# EAGLE design gearshift_controller (EAGLE 9.5.1)

## Sheet 1 of 2
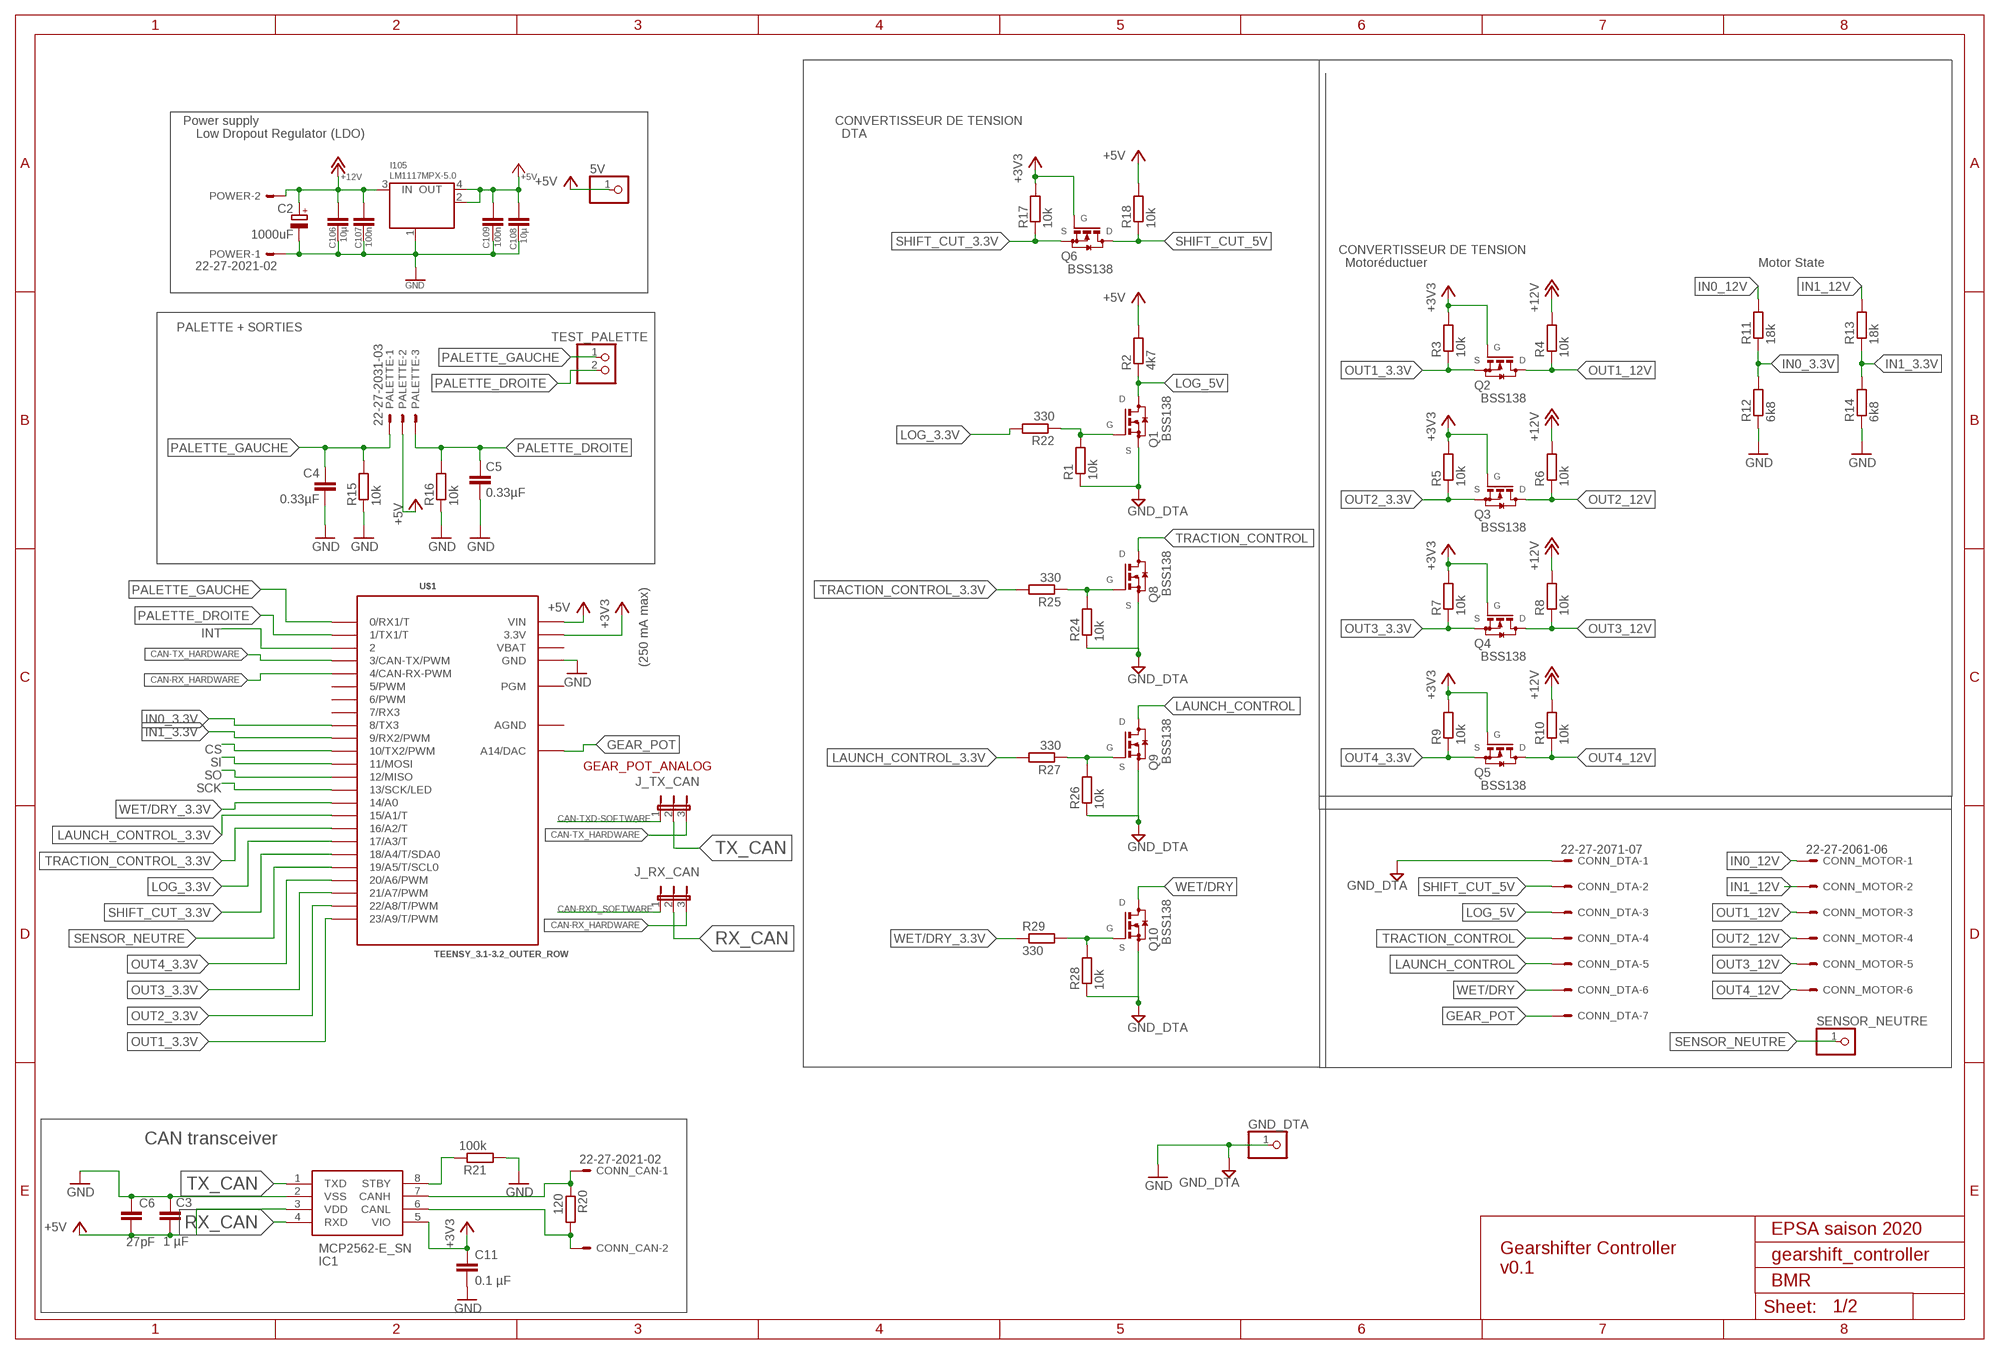
[diagram p0: schematic, sheet 1]

### Parts
5V  PINHD-1X1  [1X01]
C2  1000uF  CPOL-EUE25-10AXIAL  [E25-10]
C3  1 µF  C-EUC0805  [C0805]
C4  0.33µF  C-EUC0805  [C0805]
C5  0.33µF  C-EUC0805  [C0805]
C6  27pF  C-EUC0805  [C0805]
C11  0.1 µF  C-EUC0805  [C0805]
C106  10µ  C-EUC0805  [C0805]
C107  100n  C-EUC0603  [C0603]
C108  10µ  C-EUC0805  [C0805]
C109  100n  C-EUC0603  [C0603]
CONN_CAN  22-27-2021-02  [6410-02]
CONN_DTA  22-27-2071-07  [6410-07]
CONN_MOTOR  22-27-2061-06  [6410-06]
GND_DTA  PINHD-1X1  [1X01]
I105  LM1117MPX-5.0  0022_LM1117IMPX-5.0  [LINEAR_SOT223]
IC1  MCP2562-E_SN  [SOIC127P600X175-8N]
J_RX_CAN  JP2E  [JP2]
J_TX_CAN  JP2E  [JP2]
PALETTE  22-27-2031-03  [6410-03]
POWER  22-27-2021-02  [6410-02]
Q1  BSS138  BSS123  [SOT23]
Q2  BSS138  BSS123  [SOT23]
Q3  BSS138  BSS123  [SOT23]
Q4  BSS138  BSS123  [SOT23]
Q5  BSS138  BSS123  [SOT23]
Q6  BSS138  BSS123  [SOT23]
Q8  BSS138  BSS123  [SOT23]
Q9  BSS138  BSS123  [SOT23]
Q10  BSS138  BSS123  [SOT23]
R1  10k  R-EU_R0805  [R0805]
R2  4k7  R-EU_R0805  [R0805]
R3  10k  R-EU_R0805  [R0805]
R4  10k  R-EU_R0805  [R0805]
R5  10k  R-EU_R0805  [R0805]
R6  10k  R-EU_R0805  [R0805]
R7  10k  R-EU_R0805  [R0805]
R8  10k  R-EU_R0805  [R0805]
R9  10k  R-EU_R0805  [R0805]
R10  10k  R-EU_R0805  [R0805]
R11  18k  R-EU_R0805  [R0805]
R12  6k8  R-EU_R0805  [R0805]
R13  18k  R-EU_R0805  [R0805]
R14  6k8  R-EU_R0805  [R0805]
R15  10k  R-EU_R0805  [R0805]
R16  10k  R-EU_R0805  [R0805]
R17  10k  R-EU_R0805  [R0805]
R18  10k  R-EU_R0805  [R0805]
R20  120  R-EU_R0805  [R0805]
R21  100k  R-EU_R0805  [R0805]
R22  330  R-EU_R0805  [R0805]
R24  10k  R-EU_R0805  [R0805]
R25  330  R-EU_R0805  [R0805]
R26  10k  R-EU_R0805  [R0805]
R27  330  R-EU_R0805  [R0805]
R28  10k  R-EU_R0805  [R0805]
R29  330  R-EU_R0805  [R0805]
SENSOR_NEUTRE  PINHD-1X1  [1X01]
TEST_PALETTE  PINHD-1X2  [1X02]
U$1  TEENSY_3.1-3.2_OUTER_ROW  [TEENSY_3.0-3.2&LC_OUTER_ROW]

### Nets
+3V3: C11.1 IC1.5(VIO) Q2.1(G) Q3.1(G) Q4.1(G) Q5.1(G) Q6.1(G) R3.2 R5.2 R7.2 R9.2 R17.2 U$1.3.3V U$1.3.3V1(3.3V) ; also sheet 2
+5V: 5V.1 C3.2 C6.2 C108.1 C109.2 I105.2(OUT) I105.4(OUT) IC1.3(VDD) PALETTE.2 R2.2 R18.2 U$1.VIN
+12V: C2.+ C106.1 C107.1 I105.3(IN) POWER.2 R4.2 R6.2 R8.2 R10.2
CAN-RX_HARDWARE: J_RX_CAN.3 U$1.4(4/CAN-RX-PWM)
CAN-RXD_SOFTWARE: J_RX_CAN.1 ; also sheet 2
CAN-TX_HARDWARE: J_TX_CAN.3 U$1.3(3/CAN-TX/PWM)
CAN-TXD-SOFTWARE: J_TX_CAN.1 ; also sheet 2
CS: U$1.10(10/TX2/PWM) ; also sheet 2
GEAR_POT: CONN_DTA.7 U$1.RESET/DAC(A14/DAC)
GND: C2.- C3.1 C4.2 C5.2 C6.1 C11.2 C106.2 C107.2 C108.2 C109.1 CONN_DTA.1 GND_DTA.1 I105.1(GND/ADJ) IC1.2(VSS) POWER.1 Q1.2(S) Q8.2(S) Q9.2(S) Q10.2(S) R1.1 R12.1 R14.1 R15.1 R16.1 R21.1 R24.1 R26.1 R28.1 U$1.GND U$1.GND1(GND) ; supply symbol labelled GND_DTA ; also sheet 2
IN0_3.3V: R11.1 R12.2 U$1.8(8/TX3)
IN0_12V: CONN_MOTOR.1 R11.2
IN1_3.3V: R13.1 R14.2 U$1.9(9/RX2/PWM)
IN1_12V: CONN_MOTOR.2 R13.2
INT: U$1.2 ; also sheet 2
LAUNCH_CONTROL: CONN_DTA.5 Q9.3(D)
LAUNCH_CONTROL_3.3V: R27.2 U$1.15/A1(15/A1/T)
LOG_3.3V: R22.2 U$1.17/A3(17/A3/T)
LOG_5V: CONN_DTA.3 Q1.3(D) R2.1
N$1: Q1.1(G) R1.2 R22.1
N$2: IC1.8(STBY) R21.2
N$4: CONN_CAN.1 IC1.7(CANH) R20.1
N$6: CONN_CAN.2 IC1.6(CANL) R20.2
N$8: Q8.1(G) R24.2 R25.1
N$9: Q9.1(G) R26.2 R27.1
N$10: Q10.1(G) R28.2 R29.2
OUT1_3.3V: Q2.2(S) R3.1 U$1.23/A9(23/A9/T/PWM)
OUT1_12V: CONN_MOTOR.3 Q2.3(D) R4.1
OUT2_3.3V: Q3.2(S) R5.1 U$1.22/A8(22/A8/T/PWM)
OUT2_12V: CONN_MOTOR.4 Q3.3(D) R6.1
OUT3_3.3V: Q4.2(S) R7.1 U$1.21/A7(21/A7/PWM)
OUT3_12V: CONN_MOTOR.5 Q4.3(D) R8.1
OUT4_3.3V: Q5.2(S) R9.1 U$1.20/A6(20/A6/PWM)
OUT4_12V: CONN_MOTOR.6 Q5.3(D) R10.1
PALETTE_DROITE: C5.1 PALETTE.3 R16.2 TEST_PALETTE.2 U$1.1(1/TX1/T)
PALETTE_GAUCHE: C4.1 PALETTE.1 R15.2 TEST_PALETTE.1 U$1.0(0/RX1/T)
RX_CAN: IC1.4(RXD) J_RX_CAN.2
SCK: U$1.13(13/SCK/LED) ; also sheet 2
SENSOR_NEUTRE: SENSOR_NEUTRE.1 U$1.19/A5(19/A5/T/SCL0)
SHIFT_CUT_3.3V: Q6.2(S) R17.1 U$1.18/A4(18/A4/T/SDA0)
SHIFT_CUT_5V: CONN_DTA.2 Q6.3(D) R18.1
SI: U$1.11(11/MOSI) ; also sheet 2
SO: U$1.12(12/MISO) ; also sheet 2
TRACTION_CONTROL: CONN_DTA.4 Q8.3(D)
TRACTION_CONTROL_3.3V: R25.2 U$1.16/A2(16/A2/T)
TX_CAN: IC1.1(TXD) J_TX_CAN.2
WET/DRY: CONN_DTA.6 Q10.3(D)
WET/DRY_3.3V: R29.1 U$1.14/A0
Unconnected: U$1.5(5/PWM) U$1.6(6/PWM) U$1.7(7/RX3) U$1.PGM

### Notes on the sheet
- Power supply | CONVERTISSEUR DE TENSION
- Low Dropout Regulator (LDO) | DTA
- G
- S | D
- CONVERTISSEUR DE TENSION
- Motoréductuer | Motor State
- PALETTE + SORTIES
- G
- S | D
- D
- G
- S
- G
- S | D
- D
- G
- S | G
- S | D
- (250 mA max)
- D
- G
- G | S | D
- GEAR_POT_ANALOG | S
- D
- G
- S
- CAN transceiver
- EPSA saison 2020
- Gearshifter Controller
  v0.1
- BMR

## Sheet 2 of 2
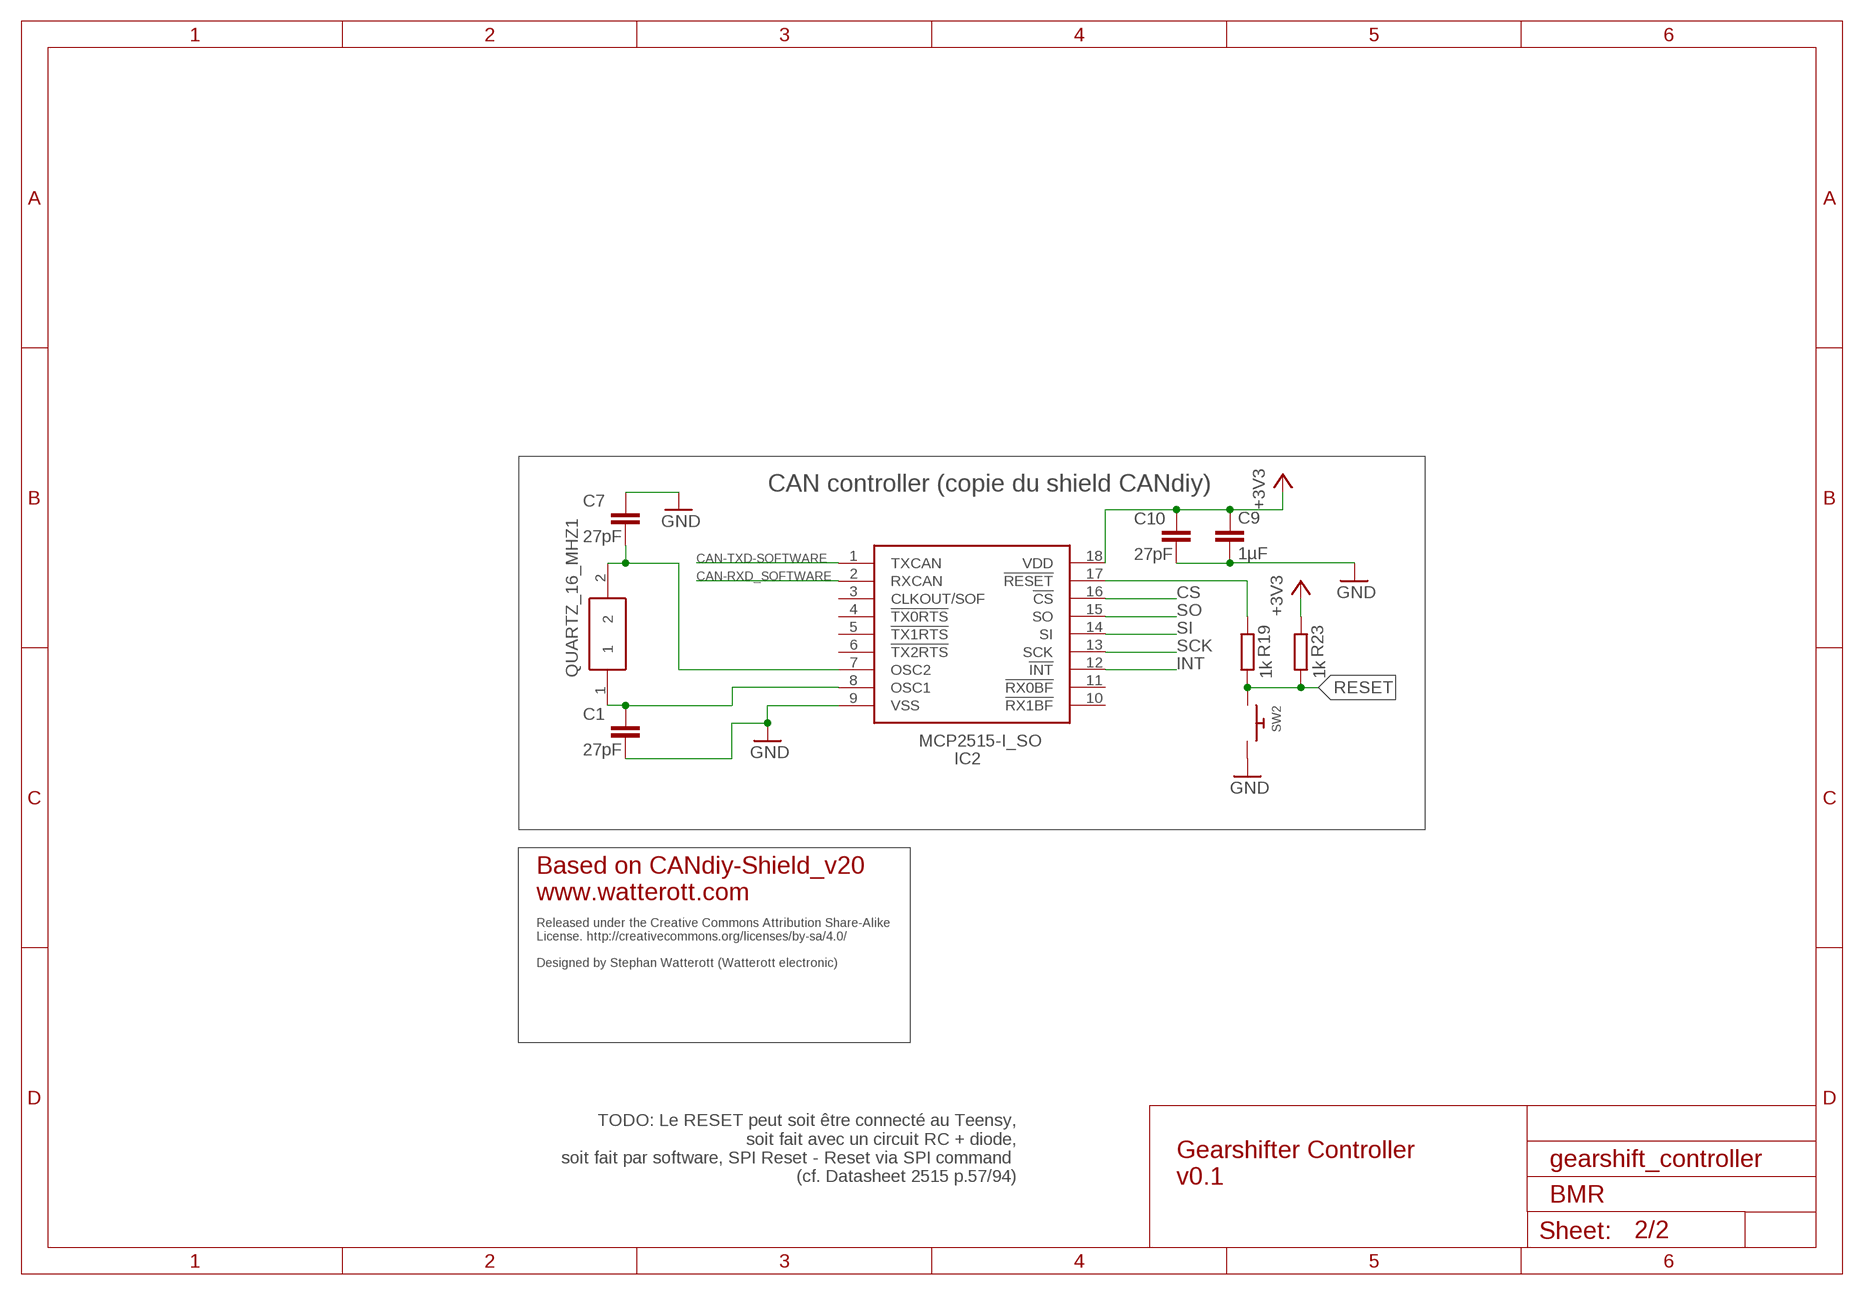
[diagram p1: schematic, sheet 2]

### Parts
C1  27pF  C-EUC0805  [C0805]
C7  27pF  C-EUC0805  [C0805]
C9  1µF  C-EUC0805  [C0805]
C10  27pF  C-EUC0805  [C0805]
IC2  MCP2515-I_SO  [SOIC127P1030X265-18N]
QUARTZ_16_MHZ1  FOXSLF_160-20  [HC49SLF_1]
R19  1k  R-EU_R0805  [R0805]
R23  1k  R-EU_R0805  [R0805]
SW2  SWITCH_PUSHBUTTONEVQ-PE  [TACT_PANA-EVQ]

### Nets
+3V3: C9.1 C10.1 IC2.18(VDD) R23.1 ; also sheet 1
CAN-RXD_SOFTWARE: IC2.2(RXCAN) ; also sheet 1
CAN-TXD-SOFTWARE: IC2.1(TXCAN) ; also sheet 1
CS: IC2.16(!CS) ; also sheet 1
GND: C1.2 C7.1 C9.2 C10.2 IC2.9(VSS) SW2.P$2 ; also sheet 1
INT: IC2.12(!INT) ; also sheet 1
N$3: C1.1 IC2.8(OSC1) QUARTZ_16_MHZ1.1
N$7: C7.2 IC2.7(OSC2) QUARTZ_16_MHZ1.2
N$11: IC2.17(!RESET) R19.1
RESET: R19.2 R23.2 SW2.P$1
SCK: IC2.13(SCK) ; also sheet 1
SI: IC2.14(SI) ; also sheet 1
SO: IC2.15(SO) ; also sheet 1
Unconnected: IC2.3(CLKOUT/SOF) IC2.4(!TX0RTS) IC2.5(!TX1RTS) IC2.6(!TX2RTS) IC2.10(!RX1BF) IC2.11(!RX0BF)

### Notes on the sheet
- CAN controller (copie du shield CANdiy)
- Based on CANdiy-Shield_v20
  www.watterott.com
- Released under the Creative Commons Attribution Share-Alike 
  License. http://creativecommons.org/licenses/by-sa/4.0/
  
  Designed by Stephan Watterott (Watterott electronic)
- TODO: Le RESET peut soit être connecté au Teensy,
   soit fait avec un circuit RC + diode,
   soit fait par software, SPI Reset - Reset via SPI command 
  (cf. Datasheet 2515 p.57/94)
- Gearshifter Controller
  v0.1
- BMR

## Power pins joined to a net without a drawn wire
AGND: U$1.AGND
VBAT: U$1.VBAT

## Library data of the parts
5V GND_DTA SENSOR_NEUTRE = pinhead:PINHD-1X1: PIN HEADER
C1 C3-C7 C9-C11 C106 C108 = rcl:C-EU: CAPACITOR, European symbol; SPICEPREFIX: C
C2 = rcl:CPOL-EU: POLARIZED CAPACITOR, European symbol; SPICEPREFIX: C
C107 C109 = rcl:C-EU: CAPACITOR, European symbol
CONN_CAN POWER = con-molex:22-?-02: CONNECTOR wire to board 2.54 mm (.1 inch) pitch header; MF: MOLEX; OC_FARNELL: unknown; OC_NEWARK: unknown
CONN_DTA = con-molex:22-?-07: CONNECTOR wire to board 2.54 mm (.1 inch) pitch header; MF: MOLEX; OC_FARNELL: unknown; OC_NEWARK: unknown
CONN_MOTOR = con-molex:22-?-06: CONNECTOR wire to board 2.54 mm (.1 inch) pitch header; MF: MOLEX; OC_FARNELL: unknown; OC_NEWARK: unknown
I105 = IntegratedCircuits:0022_LM1117IMPX-5.0: Low-dropout linear regulator 5V -LM1117IMPX-5.0; CASE: SOT223; MONTHLY_USAGE: _____; PART_NUMBER: LM1117IMPX-5.0; PRICE: _____; SUPPLIER: _____; TYPE: Circuito_Integrato; VALUE: LM1117IMPX-5.0
IC1 = MCP2562-E_SN:MCP2562-E_SN: CAN Transceiver 1Mbps 5V 125degC SOIC8 CAN Transceiver 1MBps IEC 61000-4-2 Standby-Mode 8pins SOIC Source: Datasheet <http://uk.rs-online.com/web/p/products/7990228P>; ALLIED_NUMBER: 70415107; DESCRIPTION: CAN Transceiver 1Mbps 5V 125degC SOIC8 CAN Transceiver 1MBps IEC 61000-4-2 Standby-Mode 8pins SOIC; HEIGHT: 1.75mm; MANUFACTURER_NAME: Microchip; MANUFACTURER_PART_NUMBER: MCP2562-E/SN; RS_PART_NUMBER: 7990228P
IC2 = MCP2515-I_SO:MCP2515-I_SO: CAN Controller SPI data filtering SO18 Source: Datasheet <http://uk.rs-online.com/web/p/products/1445765>; ALLIED_NUMBER: 70045399; DESCRIPTION: CAN Controller SPI data filtering SO18; HEIGHT: 2.65mm; MANUFACTURER_NAME: Microchip; MANUFACTURER_PART_NUMBER: MCP2515-I/SO; RS_PART_NUMBER: 1445765
J_RX_CAN J_TX_CAN = jumper:JP2E: JUMPER
PALETTE = con-molex:22-?-03: CONNECTOR wire to board 2.54 mm (.1 inch) pitch header; MF: MOLEX; OC_FARNELL: unknown; OC_NEWARK: unknown
Q1-Q6 Q8-Q10 = transistor-small-signal:BSS123: N-CHANNEL MOS FET
QUARTZ_16_MHZ1 = FOXSLF_160-20:FOXSLF_160-20: Crystal 16.000MHz HC49S HC-49-SLF Crystal 16MHz, ??30ppm, 2-Pin Source: Datasheet <http://uk.rs-online.com/web/p/products/1734298>; DESCRIPTION: Crystal 16.000MHz HC49S HC-49-SLF Crystal 16MHz, ??30ppm, 2-Pin; HEIGHT: mm; MANUFACTURER_NAME: Fox; MANUFACTURER_PART_NUMBER: FOXSLF/160-20; RS_PART_NUMBER: 1734298
R1-R29 = rcl:R-EU_: RESISTOR, European symbol; SPICEPREFIX: R
SW2 = adafruit:SWITCH_PUSHBUTTON: Buttons SOFTTOUCHSMD_SJ - Soft touch temporary push button (Super Junk Akihabara) Compatible with SKPMANE010 [Mouser: 688-SKPMAN] C&K_KSS = Digikey: KSS221GLFS
TEST_PALETTE = test_pin_DTA:PINHD-1X2: PIN HEADER
U$1 = Teensy_3_and_LC_Series_Boards_v1.4:TEENSY_3.1-3.2_OUTER_ROW: Footprint for Teensy 3.1 or 3.2 board using all pin connections on the outer perimeter

## Net classes
0 default: width 0.61 mm

## Board
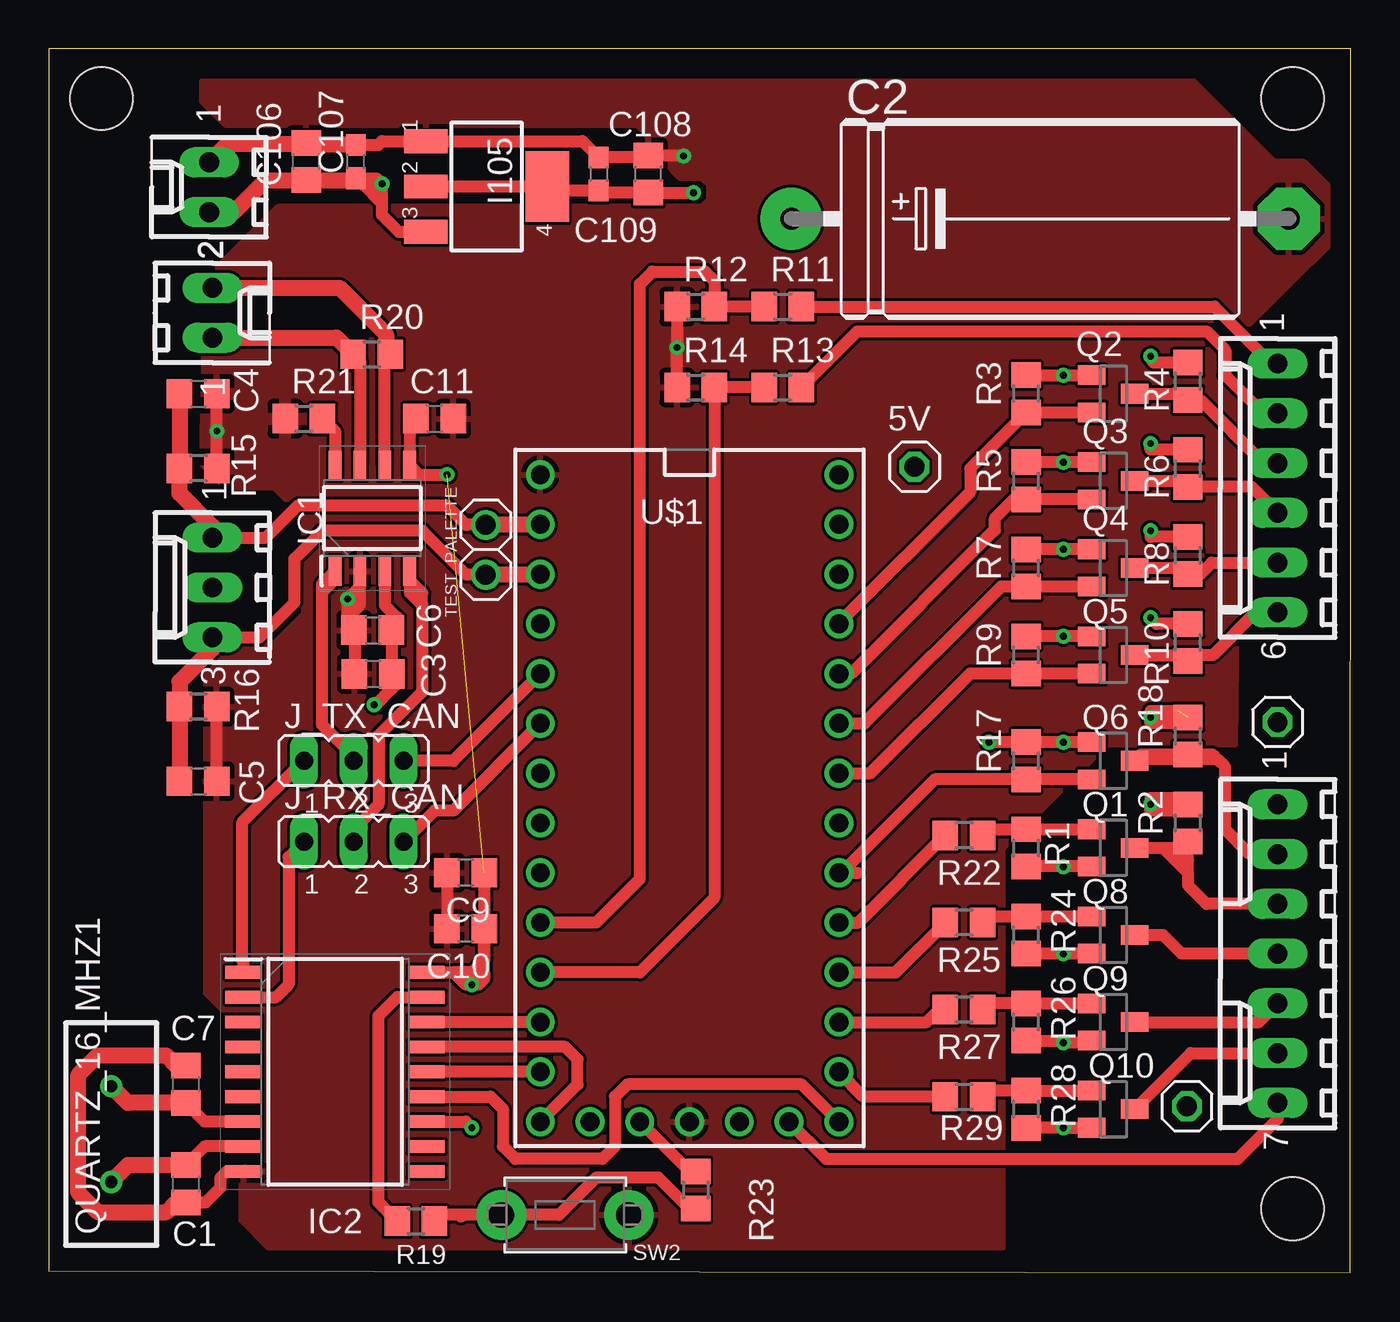
[diagram p2: board, top side]
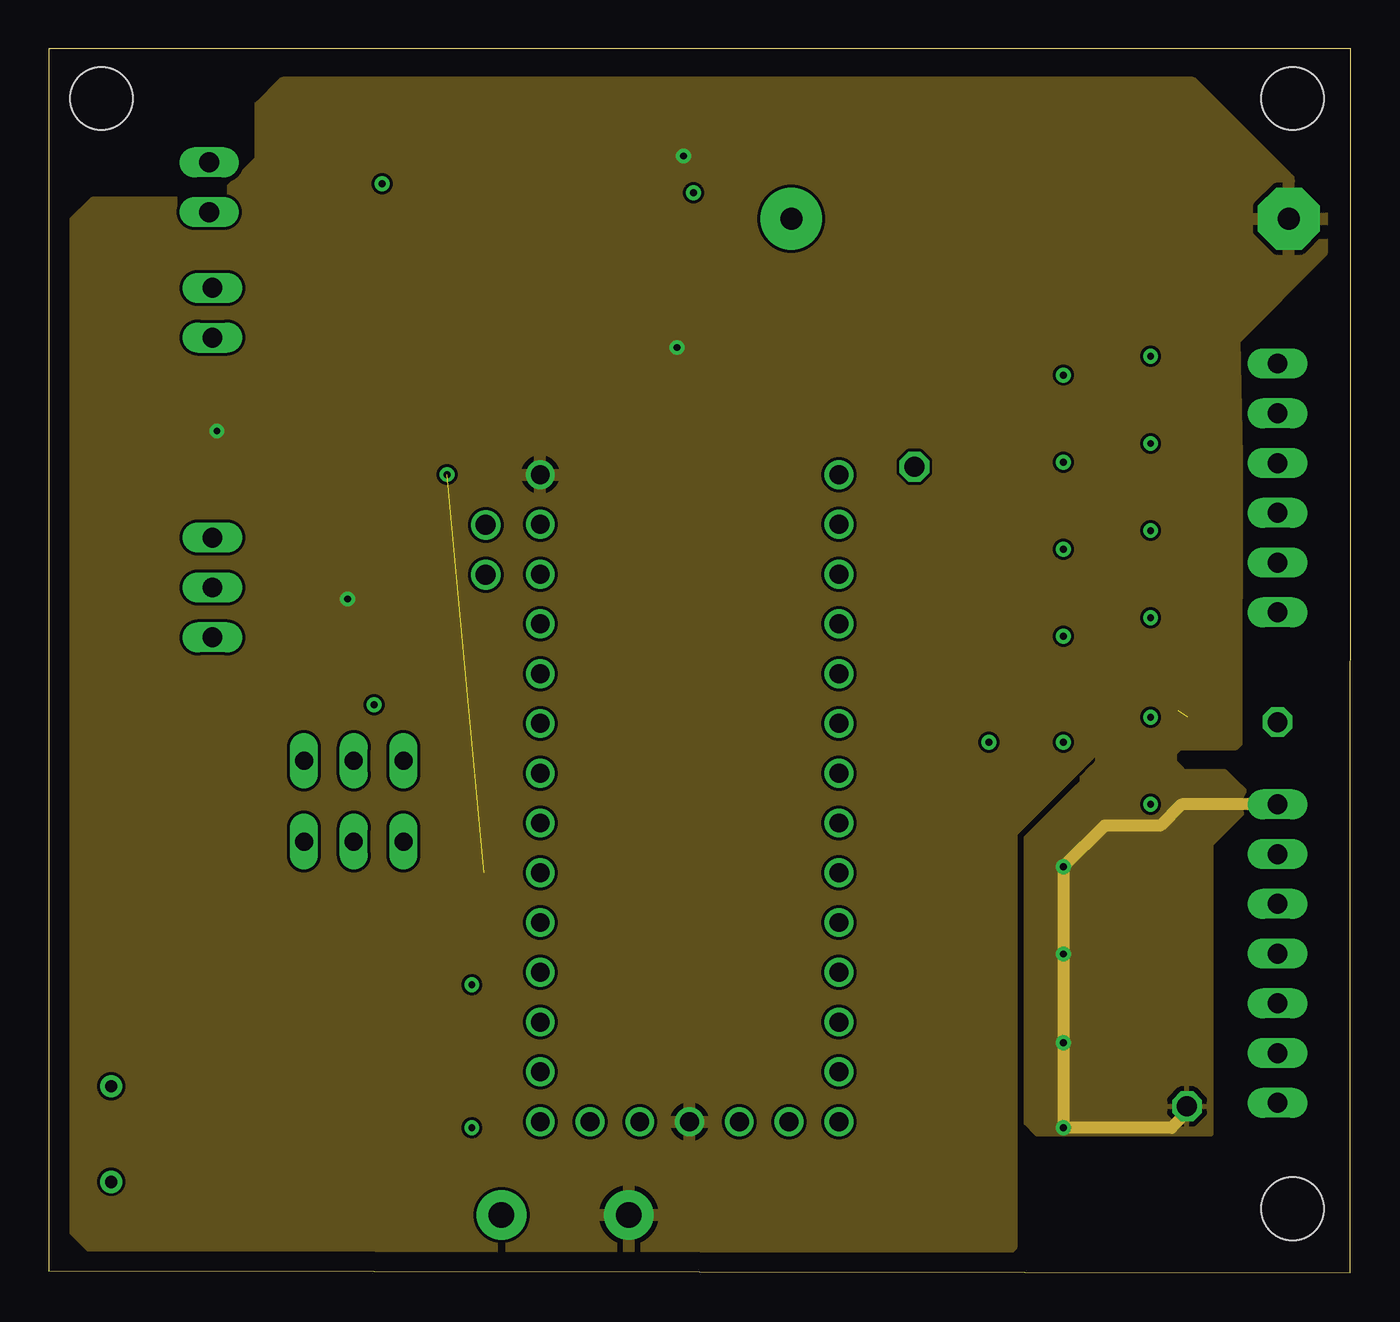
[diagram p3: board, inner layer Route2]
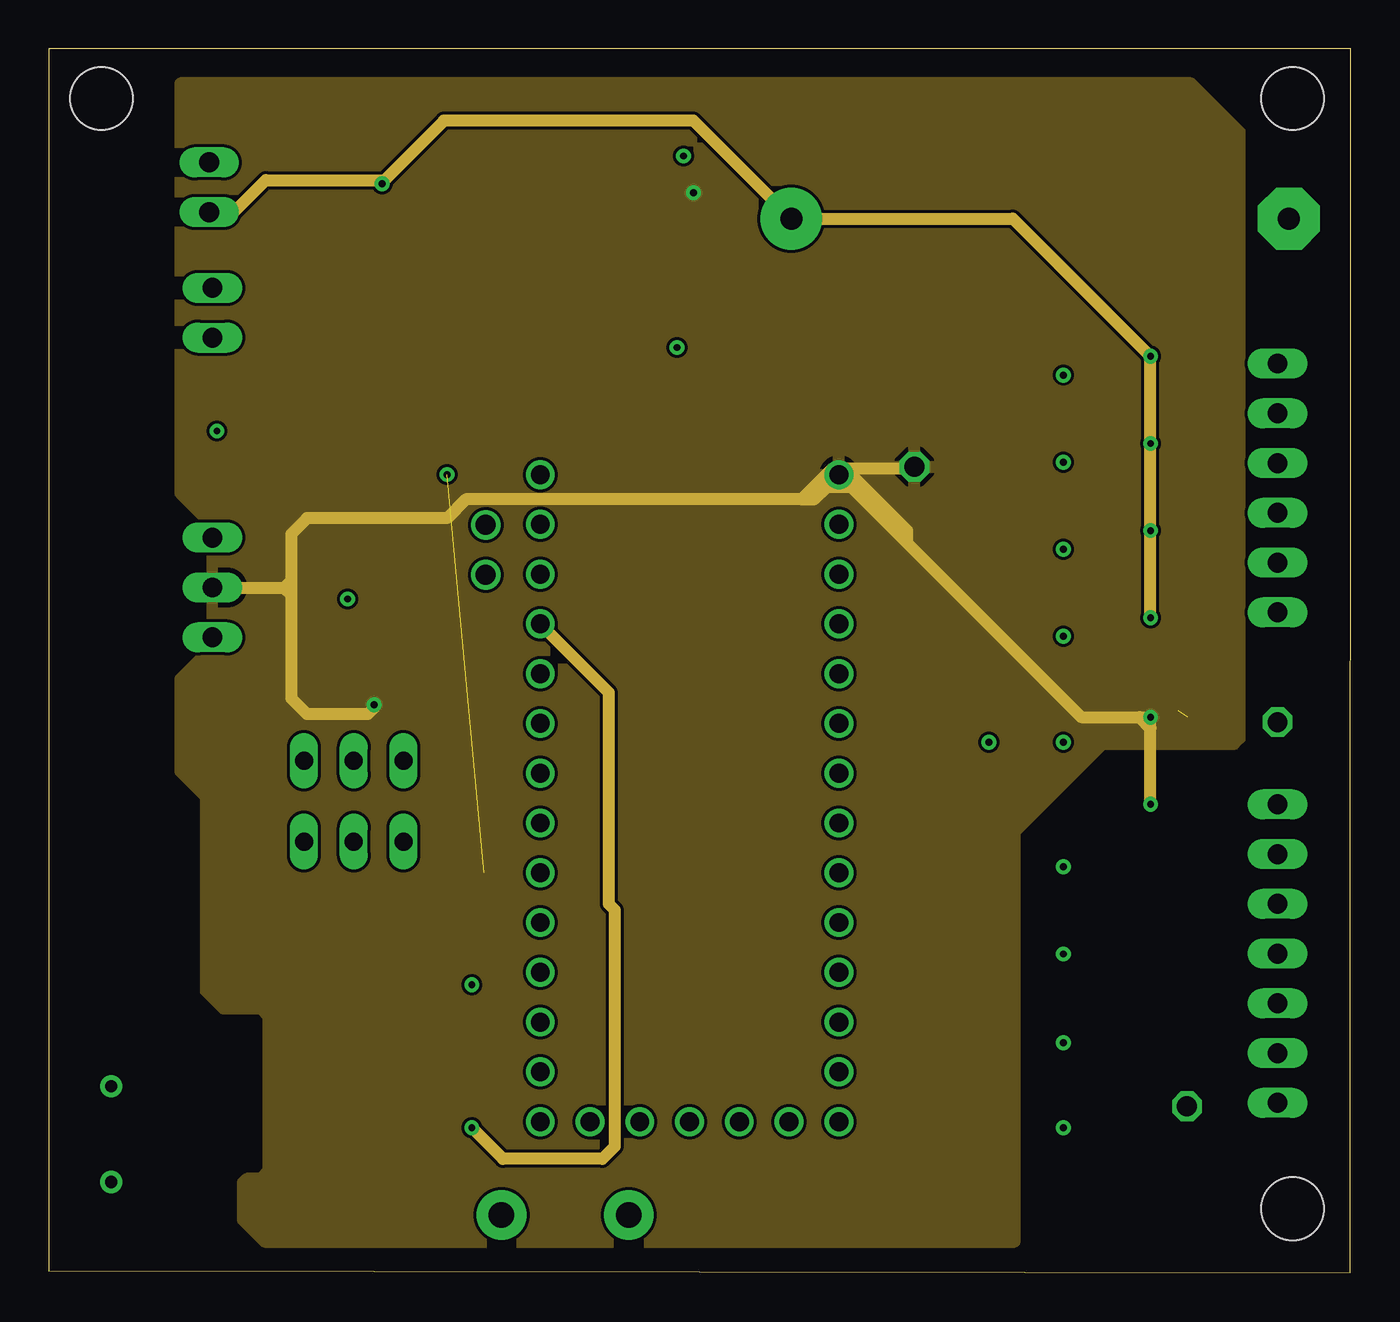
[diagram p4: board, inner layer Route15]
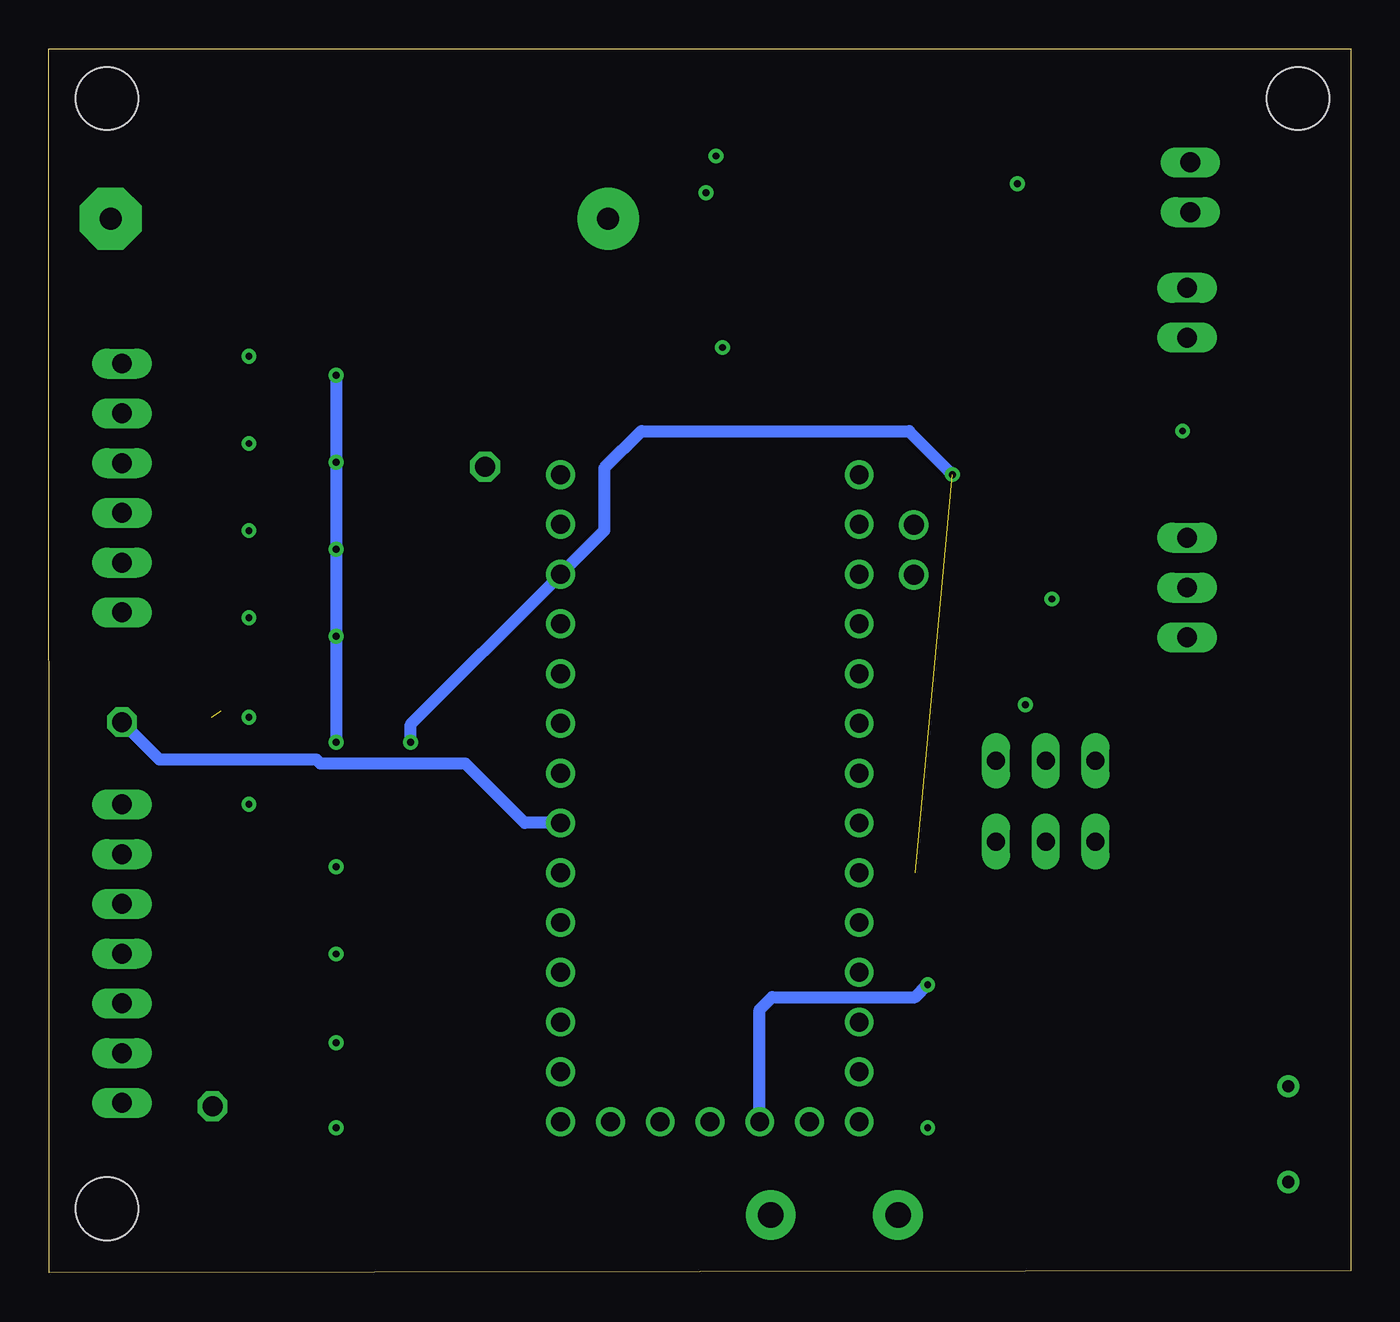
[diagram p5: board, bottom side, seen from below]

Size 66.45 x 62.44 mm. Coordinates in mm from the lower left corner, seen from the top.
Outline: 0,0.08 66.43,0 66.45,62.44 0,62.44 0,0.08
Copper layers (1+2*15+16): Top 0.035mm / dielectric 1.5mm / Route2 0.035mm / dielectric 0.15mm / Route15 0.035mm / dielectric 0.2mm / Bottom 0.035mm
Design rules "default *": minimum track width 6mil, minimum drill 0.35mm, track to track 6mil, track to pad 6mil, pad to pad 6mil, via to via 6mil, smd to smd 6mil, copper to edge 40mil, drill to drill 12mil, minimum pad ring 10mil, minimum via ring 8mil, stop-mask expansion 4mil, vias tented up to drill 0mil, thermal gap 10mil
Holes 3.2 mm at 63.49,59.92 63.49,3.26 2.67,59.92

### Footprints (pad centres in the part's own frame; a part is rotated, then mirrored left to right if it is on the bottom)
1X01 = drill 1.016 octagon: 1 0,0
C0805 = smd 1.3 x 1.5: 1 -0.95,0; 2 0.95,0
E25-10 = drill 1.118 pad 3.15: + -12.7,0 | drill 1.118 pad 3.15 octagon: - 12.7,0
C0603 = smd 1.1 x 1: 1 -0.85,0; 2 0.85,0
6410-02 = drill 1.016 long: 1 1.27,0; 2 -1.27,0
6410-07 = drill 1.016 long: 1 7.62,0; 2 5.08,0; 3 2.54,0; 4 0,0; 5 -2.54,0; 6 -5.08,0; 7 -7.62,0
6410-06 = drill 1.016 long: 1 6.35,0; 2 3.81,0; 3 1.27,0; 4 -1.27,0; 5 -3.81,0; 6 -6.35,0
LINEAR_SOT223 = smd 1.219 x 2.235: 1 -2.311,-3.099; 2 0,-3.099; 3 2.311,-3.099 | smd 3.6 x 2.2: 4 0,3.099
SOIC127P600X175-8N = smd 1.5 x 0.65: 1 -2.7,1.905; 2 -2.7,0.635; 3 -2.7,-0.635; 4 -2.7,-1.905; 5 2.7,-1.905; 6 2.7,-0.635; 7 2.7,0.635; 8 2.7,1.905
SOIC127P1030X265-18N = smd 1.85 x 0.65: 1 -4.675,5.08; 2 -4.675,3.81; 3 -4.675,2.54; 4 -4.675,1.27; 5 -4.675,0; 6 -4.675,-1.27; 7 -4.675,-2.54; 8 -4.675,-3.81; 9 -4.675,-5.08; 10 4.675,-5.08; 11 4.675,-3.81; 12 4.675,-2.54; 13 4.675,-1.27; 14 4.675,0; 15 4.675,1.27; 16 4.675,2.54; 17 4.675,3.81; 18 4.675,5.08
JP2 = drill 0.914 long: 1 -2.54,0; 2 0,0; 3 2.54,0
6410-03 = drill 1.016 long: 1 2.54,0; 2 0,0; 3 -2.54,0
SOT23 = smd 1 x 1.4: 1 -0.95,-1.1; 2 0.95,-1.1; 3 0,1.1
HC49SLF_1 = drill 0.63 pad 1.13: 1 -2.44,0; 2 2.44,0
R0805 = smd 1.3 x 1.5: 1 -0.95,0; 2 0.95,0
TACT_PANA-EVQ = drill 1.3 pad 2.54: P$1 -3.25,0; P$2 3.25,0
1X02 = drill 1.016: 1 -1.27,0; 2 1.27,0
TEENSY_3.0-3.2&LC_OUTER_ROW = drill 0.965: 0 -7.62,13.97; 1 -7.62,11.43; 2 -7.62,8.89; 3 -7.62,6.35; 3.3V 7.62,11.43; 3.3V1 -2.54,-16.51; 4 -7.62,3.81; 5 -7.62,1.27; 6 -7.62,-1.27; 7 -7.62,-3.81; 8 -7.62,-6.35; 9 -7.62,-8.89; 10 -7.62,-11.43; 11 -7.62,-13.97; 12 -7.62,-16.51; 13 7.62,-16.51; 14/A0 7.62,-13.97; 15/A1 7.62,-11.43; 16/A2 7.62,-8.89; 17/A3 7.62,-6.35; 18/A4 7.62,-3.81; 19/A5 7.62,-1.27; 20/A6 7.62,1.27; 21/A7 7.62,3.81; 22/A8 7.62,6.35; 23/A9 7.62,8.89; AGND 7.62,13.97; GND -7.62,16.51; GND1 0,-16.51; PGM 2.54,-16.51; RESET/DAC 5.08,-16.51; VBAT -5.08,-16.51; VIN 7.62,16.51

### Placement (x,y rotation side)
5V  44.18,41.12 0 top
C1  6.99,4.53 270 top
C2  50.6,53.78 0 top
C3  16.55,30.55 0 top
C4  7.62,44.85 0 top
C5  7.62,25.07 0 top
C6  16.53,32.79 0 top
C7  6.99,9.61 270 top
C9  21.27,20.4 180 top
C10  21.27,17.54 180 top
C11  19.68,43.58 0 top
C106  13.13,56.7 90 top
C107  15.68,56.7 90 top
C108  30.6,56.06 90 top
C109  28.06,56.06 270 top
CONN_CAN  8.34,48.98 270 top
CONN_DTA  62.72,16.27 90 top
CONN_MOTOR  62.72,40.04 90 top
GND_DTA  58.1,8.48 180 top
I105  22.34,55.43 270 top
IC1  16.51,38.5 90 top
IC2  14.61,10.24 0 top
J_RX_CAN  15.56,21.99 0 top
J_TX_CAN  15.56,26.12 0 top
PALETTE  8.34,34.96 90 top
POWER  8.18,55.39 90 top
Q1  54.33,21.67 270 top
Q2  54.33,44.85 270 top
Q3  54.33,40.41 270 top
Q4  54.33,35.96 270 top
Q5  54.33,31.52 270 top
Q6  54.33,26.12 270 top
Q8  54.33,17.23 270 top
Q9  54.33,12.78 270 top
Q10  54.33,8.34 270 top
QUARTZ_16_MHZ1  3.17,7.07 90 top
R1  49.89,21.67 90 top
R2  58.14,22.94 90 top
R3  49.89,44.85 90 top
R4  58.14,45.49 90 top
R5  49.89,40.41 90 top
R6  58.14,41.04 90 top
R7  49.89,35.96 90 top
R8  58.14,36.6 90 top
R9  49.89,31.52 90 top
R10  58.14,32.15 90 top
R11  37.47,49.3 0 top
R12  33.02,49.3 0 top
R13  37.47,45.17 0 top
R14  33.02,45.17 0 top
R15  7.62,41.04 180 top
R16  7.62,28.88 180 top
R17  49.89,26.12 90 top
R18  58.14,27.39 90 top
R19  18.73,2.62 0 top
R20  16.48,46.87 0 top
R21  13.02,43.58 0 top
R22  46.71,22.31 180 top
R23  33.02,4.21 270 top
R24  49.89,17.23 90 top
R25  46.71,17.86 180 top
R26  49.89,12.78 90 top
R27  46.71,13.42 180 top
R28  49.89,8.34 90 top
R29  46.71,8.97 0 top
SENSOR_NEUTRE  62.72,28.09 0 top
SW2  26.35,2.94 0 top
TEST_PALETTE  22.3,36.88 270 top
U$1  32.7,24.21 0 top

### Tracks (layer width: path | path; a pad name or v marks a point on that pad's centre or on a via)
+3V3  (via drill 0.35)  (1 unrouted)
  Top 0.61: C11.1 18.41,43.26 IC1.5 18.89,40.72 v20.32,40.72 | v47.98,27.07 R17.2 v51.8,27.07 | R3.2 v51.79,45.8 Q2.1 | C9.1 C10.1 | IC2.18 20.64,15.32 | R23.1 32.7,5.16 U$1.3.3V1 | 22.22,15.32 C10.1 | 20.64,15.32 21.27,14.69 v21.59,14.69 21.91,14.69 22.23,15 22.23,15.32 22.22,15.32 | 21.59,15.32 20.64,15.32 | C10.1 22.22,15.96 21.59,15.32 | 22.22,15.32 21.59,15.32 | Q6.1 v51.8,27.07 | Q5.1 v51.8,32.47 | v51.8,32.47 R9.2 | v51.79,32.47 v51.8,32.47 | Q4.1 v51.8,36.91 | v51.8,36.91 R7.2 | v51.79,36.91 v51.8,36.91 | v51.79,27.07 v51.8,27.07 | Q3.1 v51.8,41.36 | v51.8,41.36 R5.2 | v51.79,41.36 v51.8,41.36
  Bottom 0.61: v47.98,27.07 47.98,27.97 40.61,35.34 40.61,35.36 U$1.3.3V 38.1,37.86 38.1,41.04 36.2,42.94 22.54,42.94 v20.32,40.72 | v51.79,27.07 v51.79,32.47 v51.79,36.91 v51.79,41.36 v51.79,45.8 | U$1.3.3V1 30.16,13.42 29.53,14.05 22.23,14.05 v21.59,14.69
+5V  (via drill 0.35)  (1 unrouted)
  Top 0.61: IC1.3 17.14,34.05 17.78,33.42 17.78,32.78 | 17.8,32.76 17.78,32.78 | I105.2 I105.4 25.44,55.27 25.5,55.21 C109.2 28.16,55.11 C108.1 v32.91,55.11 | 57.67,28.66 56.24,28.66 56.24,28.02 57.57,28.02 | v56.24,28.34 R18.2 | 17.5,29.78 16.69,28.97 v16.6,28.97 | 17.78,32.78 17.78,32.48 C6.2 17.5,32.76 C3.2 17.5,29.78 | R2.2 57.83,23.89 57.51,24.21 56.24,24.21 v56.24,23.89 56.24,23.58 | R2.2 57.83,23.58 56.24,23.58 | R2.2 56.55,23.89 56.24,23.58 | 17.5,29.78 17.8,30.08
  Route15 0.61: U$1.VIN 52.7,28.34 55.68,28.34 | U$1.VIN 40.32,41.04 | 44.16,41.11 44.16,41.04 40.64,41.04 | v16.6,28.97 16.6,28.82 16.28,28.5 13.18,28.5 12.38,29.29 12.38,34.58 | v56.24,23.89 56.24,27.78 | 39.69,40.09 39.05,39.45 38.42,39.45 | 39.69,40.09 U$1.VIN | U$1.VIN 40.96,40.09 39.69,40.09 | 38.42,39.45 40.01,41.04 40.32,41.04 | 43.81,37.23 43.81,37.86 40.64,41.04 | 40.64,41.04 40.32,41.04 | 38.42,39.45 21.27,39.45 20.32,38.5 13.18,38.5 12.38,37.7 12.38,35.34 | PALETTE.2 12.01,34.96 | 12.01,34.96 12.38,34.58 | 12.38,34.58 12.38,35.34 | 12.38,35.34 12.01,34.96 | 56.24,27.78 55.68,28.34 | 55.68,28.34 v56.24,28.34 56.24,27.78
  pour Route15: 8,14.38 8.9,13.48 10.8,13.48 11.2,13.08 11.2,5.18 10.8,4.78 10.1,4.78 9.9,4.58 9.9,2.68 11,1.58 49.3,1.58 49.3,22.48 53.8,26.98 60.5,26.98 60.8,27.28 60.8,58.18 58.3,60.68 6.7,60.68 6.7,39.78 8.34,38.14 8.34,31.92 6.7,30.28 6.7,25.58 8,24.28
+12V  (via drill 0.35)
  Top 0.61: 16.46,55.56 v17.01,55.56 | 17.01,54.58 17.01,53.96 17.86,53.11 I105.3 | 17.01,54.58 17.01,55.02 | 17.01,55.02 v17.01,55.56 | v56.24,46.75 v56.24,46.76 56.4,46.43 R4.2 | R8.2 57.51,37.54 57.51,37.55 56.24,37.55 v56.24,37.86 | v56.24,33.42 56.56,33.1 R10.2 | R6.2 56.24,41.99 v56.24,42.31 | 17.01,55.02 16.46,55.56 | 16.28,55.75 16,55.75 16,55.59 17.01,54.58 | 16.28,55.75 16.46,55.56 | 16.28,55.75 16.83,55.75 v17.01,55.56 | C107.1 16.73,55.85 v17.01,55.56
  Top 0.813: POWER.2 9.44,54.12 11.06,55.75 C106.1 16,55.75
  Route15 0.61: v56.24,33.42 v56.24,37.86 v56.24,42.31 v56.24,46.75 49.21,53.78 C2.+ 32.9,58.78 20.17,58.78 17.14,55.75 11.07,55.75 9.44,54.12 POWER.2 | 16.9,55.67 v17.01,55.56
CAN-RX_HARDWARE
  Top 0.61: U$1.4 20.64,23.58 19.68,23.58 J_RX_CAN.3
CAN-RXD_SOFTWARE
  Top 0.61: J_RX_CAN.1 12.22,21.2 12.22,14.69 11.59,14.05 IC2.2
CAN-TX_HARDWARE
  Top 0.61: U$1.3 20.64,26.12 J_TX_CAN.3
CAN-TXD-SOFTWARE
  Top 0.61: IC2.1 9.93,15.87 9.84,15.96 9.84,22.94 J_TX_CAN.1
CS
  Top 0.61: U$1.10 IC2.16
GEAR_POT
  Top 0.61: CONN_DTA.7 62.72,7.84 60.68,5.8 39.69,5.8 U$1.RESET/DAC
GND  (via drill 0.35)
  Top 0.61: 15.88,34.69 15.88,34.05 15.24,33.42 | 15.88,34.69 IC1.2 15.88,35.01 15.56,34.69 | 15.26,30.89 C3.1 15.6,32.76 C6.1 15.24,33.12 v15.24,34.37 15.56,34.69 | 13.02,57.64 C106.2 13.23,57.54 | C9.2 C10.2 | R15.1 v8.57,42.94 v8.57,42.95 C4.2 | C5.2 R16.1 | 15.56,34.69 15.88,34.69 | R14.1 v32.07,47.21 R12.1 | v32.4,56.98 32.37,57.01 C108.2 30.5,56.91 C109.1 27.23,57.74 I105.1 17,57.74 16.81,57.54 C107.2 | 6.5,10.56 C7.1 | 6.5,3.58 C1.2 8,3.58 8.75,4.33 8.75,4.83 9.08,5.16 IC2.9 | Q8.2 51.79,16.28 | 51.79,16.28 R24.1 | 51.79,16.28 v51.79,16.26 | Q9.2 53.13,11.73 v51.79,11.73 51.69,11.83 R26.1 | Q1.2 51.79,20.72 v51.79,20.7 51.77,20.72 R1.1 | Q10.2 v51.79,7.39 R28.1
  Top 0.813: 13.02,57.64 13.06,57.6 9.12,57.6 POWER.1 | C107.2 13.23,57.54 | 6.5,10.56 5.97,11.08 2.5,11.08 1.5,10.08 1.5,4.08 2.5,3.08 6,3.08 6.5,3.58
  Route2 0.61: CONN_DTA.1 57.81,23.89 56.73,22.81 53.9,22.81 51.81,20.72 | v51.79,20.7 v51.79,16.26 v51.79,11.73 v51.79,7.39 v51.8,7.38 57.3,7.38 58.1,8.18 GND_DTA.1
  Bottom 0.61: U$1.GND1 33.02,7.39
  pour Top: 13.55,43.53 11.9,45.18 9,45.18 8.3,44.48 8.3,41.28 8.99,40.59 10.61,40.59
  pour Top: 7.8,60.78 7.8,59.78 9,58.58 30,58.58 30.5,58.08 30.5,57.08 31,56.58 31.5,56.58 32.2,55.88 33.3,55.88 33.7,55.48 33.7,54.78 33.3,54.38 11.7,54.38 7.97,50.66 7.8,41.28 9,40.08 11.5,40.08 13,38.58 13,33.58 11.5,32.08 8.5,32.08 8,31.58 8,14.28 9.4,12.88 10.7,12.88 11.2,12.38 11.2,5.58 11,5.38 10,5.38 9.8,5.18 9.8,2.68 11.2,1.28 48.7,1.28 48.7,21.66 54,26.96 60.55,26.96 60.83,47.96 65.56,52.66 65.56,55.17 64.05,56.68 62.55,56.68 58.45,60.78
  pour Route2: 65,54.09 64.93,54.15 58.38,60.71 11.95,60.71 10.78,59.53 10.78,56.76 8.62,54.61 2.3,54.61 1.25,53.56 1.25,2.21 2.62,0.83 48.62,0.83 49.15,1.36 49.15,22.46 53.65,26.96 60.53,26.96 60.65,27.08 60.66,41.62 60.66,41.62 60.53,47.61 65,52.08
  pour Route2 (rank 2): 53.4,26.98 53.7,26.68 53.7,25.98 53.42,25.68 53.4,25.68 52.8,25.08 58.2,25.08 57.3,25.98 57.3,26.58 57.7,26.98
  pour Route2 (rank 2): 51.72,24.07 49.84,22.18 49.84,7.63 50.41,7.07 59.37,7.07 59.37,21.86 61.58,24.07 60.07,25.58 53.26,25.58
IN0_3.3V
  Top 0.61: R11.1 R12.2 33.97,50.61 33.5,51.08 30.8,51.08 30.16,50.44 30.16,20.09 27.94,17.86 U$1.8
IN0_12V
  Top 0.61: R11.2 59.5,49.29 62.41,46.39 CONN_MOTOR.1
IN1_3.3V
  Top 0.61: R13.1 R14.2 33.97,19.13 30.16,15.32 U$1.9
IN1_12V
  Top 0.61: R13.2 41.27,48.03 59.1,48.03 60.05,47.08 60.05,45.8 62,43.85 CONN_MOTOR.2
INT  (via drill 0.35)
  Top 0.61: IC2.12 21.27,7.7 v21.59,7.39
  Route15 0.61: U$1.2 28.57,29.61 28.57,18.82 28.89,18.5 28.89,6.43 28.26,5.8 23.18,5.8 v21.59,7.39
LAUNCH_CONTROL
  Top 0.61: CONN_DTA.5 61.77,12.78 Q9.3
LAUNCH_CONTROL_3.3V
  Top 0.61: R27.2 45.44,13.42 44.81,12.78 U$1.15/A1
LOG_3.3V
  Top 0.61: U$1.17/A3 41.32,17.86 R22.2
LOG_5V
  Top 0.61: CONN_DTA.3 59.09,18.82 58.14,19.77 58.14,20.4 | 58.14,20.4 58.14,21.04 | 58.14,21.04 R2.1 | Q1.3 56.87,21.67 | 56.87,21.67 57.51,21.67 58.14,21.04 | 56.87,21.67 58.14,20.4
N$1
  Top 0.61: Q1.1 R1.2 47.98,22.62 R22.1
N$2
  Top 0.61: R21.2 14.61,42.94 IC1.8
N$3
  Top 0.61: IC2.8 7.94,6.43 C1.1
  Top 0.813: C1.1 4.03,5.48 QUARTZ_16_MHZ1.1
N$4
  Top 0.61: 11.52,47.71 CONN_CAN.1 | R20.1 15.88,46.52 IC1.7
  Top 0.813: R20.1 14.69,47.71 CONN_CAN.1
N$6
  Top 0.61: 17.14,46.44 IC1.6 17.14,47.04 17.2,47.09
  Top 0.813: R20.2 17.2,47.09 17.2,47.88 14.83,50.25 CONN_CAN.2
N$7
  Top 0.61: IC2.7 7.94,7.7 C7.2
  Top 0.813: C7.2 4.03,8.66 QUARTZ_16_MHZ1.2
N$8
  Top 0.61: R25.1 47.98,18.18 R24.2 Q8.1
N$9
  Top 0.61: Q9.1 R26.2 47.98,13.73 R27.1
N$10
  Top 0.61: R29.2 47.98,9.29 R28.2 Q10.1
N$11
  Top 0.61: R19.1 16.83,3.58 16.83,13.1 17.78,14.05 IC2.17
OUT1_3.3V
  Top 0.61: Q2.2 R3.1 47.03,41.04 47.03,39.83 40.3,33.1 U$1.23/A9
OUT1_12V
  Top 0.61: Q2.3 57.83,44.85 R4.1 58.77,44.54 62,41.31 CONN_MOTOR.3
OUT2_3.3V
  Top 0.61: Q3.2 R5.1 49.25,39.45 48.3,38.5 48.3,37.89 40.97,30.56 U$1.22/A8
OUT2_12V
  Top 0.61: Q3.3 57.83,40.4 R6.1 61.4,40.09 CONN_MOTOR.4
OUT3_3.3V
  Top 0.61: R7.1 49.63,35.01 | R7.1 48.62,35.01 41.63,28.02 U$1.21/A7 | Q4.2 R7.1
OUT3_12V
  Top 0.61: Q4.3 57.83,35.96 R8.1 58.78,35.64 59.37,36.23 CONN_MOTOR.5
OUT4_3.3V
  Top 0.61: Q5.2 50.18,30.57 50.04,30.71 R9.1 47.03,30.57 41.95,25.48 U$1.20/A6
OUT4_12V
  Top 0.61: 57.83,31.52 R10.1 | CONN_MOTOR.6 61.59,33.69 59.41,31.52 57.83,31.52 | Q5.3 57.83,31.52
PALETTE_DROITE
  Top 0.61: 8.34,31.82 PALETTE.3 10.75,32.42 12.54,34.21 12.54,36.44 13.97,37.86 19.05,37.86 21.3,35.61 TEST_PALETTE.2
  Top 0.813: C5.1 R16.2 6.67,30.15 8.34,31.82 | U$1.1 25.05,35.61 TEST_PALETTE.2
PALETTE_GAUCHE
  Top 0.61: 8.34,38.1 PALETTE.1 11.06,37.5 12.7,39.14 20.32,39.14 21.3,38.15 TEST_PALETTE.1
  Top 0.813: C4.1 R15.2 6.67,39.77 8.34,38.1 | U$1.0 25.05,38.15 TEST_PALETTE.1
RESET
  Top 0.61: R19.2 20.01,2.95 21.11,2.95 21.03,2.87 21.2,2.94 SW2.P$1 26.04,2.94 27.94,4.85 31.11,4.85 32.7,3.26 R23.2
RX_CAN
  Top 0.61: J_RX_CAN.2 15.56,22.63 16.83,23.89 16.83,27.41 19.05,29.63 19.05,34.05 | IC1.4 18.41,35.32 | 18.41,35.32 18.41,34.69 19.05,34.05 | 19.05,34.05 19.05,34.69 18.41,35.32
SCK
  Top 0.61: IC2.13 22.54,8.97 23.18,8.34 23.18,6.43 23.81,5.8 28.26,5.8 28.89,6.43 28.89,8.97 29.53,9.61 38.42,9.61 U$1.13
SENSOR_NEUTRE
  Bottom 0.61: U$1.19/A5 42.16,22.94 45.2,25.98 52.6,25.98 52.8,26.18 60.81,26.18 SENSOR_NEUTRE.1
SHIFT_CUT_3.3V
  Top 0.61: Q6.2 R17.1 45.23,25.17 40.46,20.4 U$1.18/A4 41.27,20.4
SHIFT_CUT_5V
  Top 0.61: Q6.3 55.52,26.2 | 55.52,26.2 55.75,26.44 R18.1 59.41,26.44 59.65,26.2 | 59.65,26.2 60.05,25.8 60.05,22.63 61.32,21.36 CONN_DTA.2 | 59.65,26.2 55.52,26.2
SI
  Top 0.61: U$1.11 IC2.14
SO
  Top 0.61: IC2.15 26.35,11.51 26.99,10.88 26.99,9.61 U$1.12
TRACTION_CONTROL
  Top 0.61: CONN_DTA.4 57.83,16.27 56.87,17.23 Q8.3
TRACTION_CONTROL_3.3V
  Top 0.61: U$1.16/A2 43.22,15.32 R25.2
TX_CAN
  Top 0.61: J_TX_CAN.2 15.56,26.34 13.92,27.97 13.92,34.69 | 13.92,34.69 13.92,35.12 IC1.1 14.61,35.37 13.92,34.69
WET/DRY
  Top 0.61: CONN_DTA.6 58.29,11.2 Q10.3
WET/DRY_3.3V
  Top 0.61: U$1.14/A0 41.59,8.97 R29.1

### Text on the board
tValues: SENSOR / NEUTRE | SHIFT CUT | LOG | TRACTION | LAUNCH | WET/DRY | GEAR POT | Gearbox_controller / INVICTUS